# EAGLE design bridge (EAGLE 7.7.0)
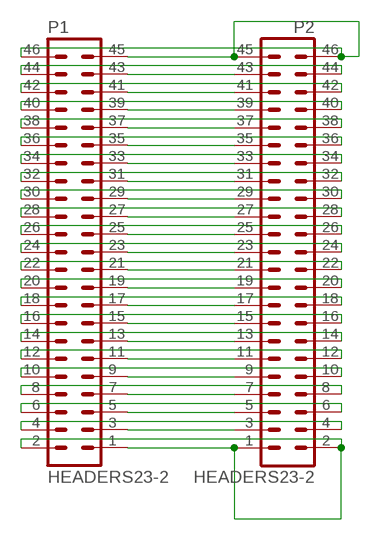
[diagram p0: schematic, sheet 1]

## Parts
P1  HEADERS23-2  [MA23-2]
P2  HEADERS23-2  [MA23-2]

## Nets
GND: P1.1 P1.2 P1.45 P1.46 P2.1 P2.2 P2.45 P2.46
N$2: P1.3 P2.3
N$3: P1.5 P2.5
N$4: P1.7 P2.7
N$5: P1.9 P2.9
N$6: P1.11 P2.11
N$7: P1.13 P2.13
N$8: P1.15 P2.15
N$9: P1.17 P2.17
N$10: P1.19 P2.19
N$11: P1.21 P2.21
N$12: P1.23 P2.23
N$13: P1.25 P2.25
N$14: P1.27 P2.27
N$15: P1.29 P2.29
N$16: P1.31 P2.31
N$17: P1.33 P2.33
N$18: P1.35 P2.35
N$19: P1.37 P2.37
N$20: P1.39 P2.39
N$21: P1.41 P2.41
N$22: P1.43 P2.43
N$25: P1.4 P2.4
N$26: P1.6 P2.6
N$27: P1.8 P2.8
N$28: P1.10 P2.10
N$29: P1.12 P2.12
N$30: P1.14 P2.14
N$31: P1.16 P2.16
N$32: P1.18 P2.18
N$33: P1.20 P2.20
N$34: P1.22 P2.22
N$35: P1.24 P2.24
N$36: P1.26 P2.26
N$37: P1.28 P2.28
N$38: P1.30 P2.30
N$39: P1.32 P2.32
N$40: P1.34 P2.34
N$41: P1.36 P2.36
N$42: P1.38 P2.38
N$43: P1.40 P2.40
N$44: P1.42 P2.42
N$45: P1.44 P2.44

## Library data of the parts
P1 P2 = 0000halfgaar:HEADERS23-2: Header 23x2

## Board
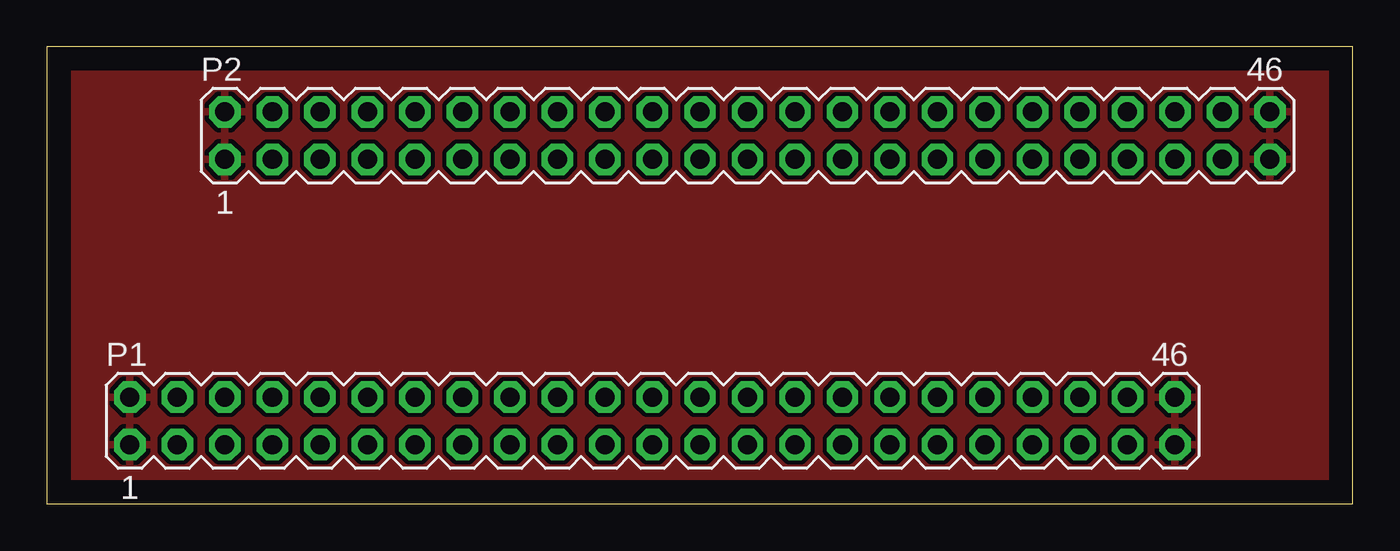
[diagram p1: board, top side]
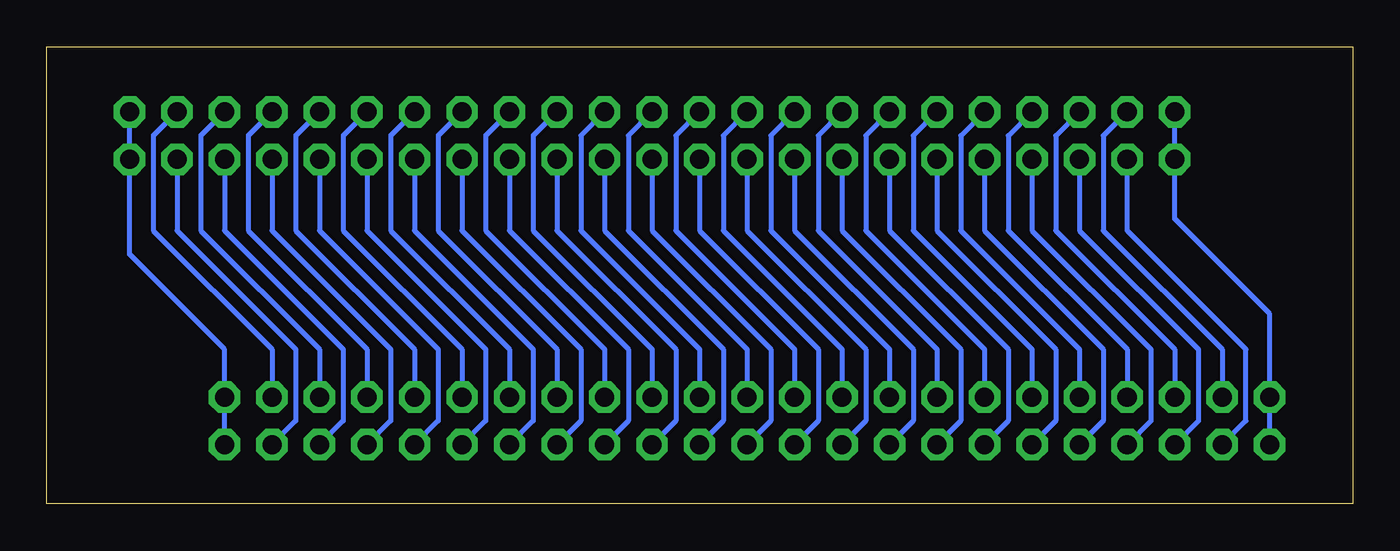
[diagram p2: board, bottom side, seen from below]

Size 69.83 x 24.43 mm. Coordinates in mm from the lower left corner, seen from the top.
Outline: 0,0 69.83,0 69.83,24.43 0,24.43 0,0
Copper layers (1*16): Top 0.035mm / dielectric 1.6mm / Bottom 0.035mm
Design rules "verysmall": minimum track width 10mil, minimum drill 31mil, track to track 9mil, track to pad 8mil, pad to pad 7mil, via to via 20mil, smd to smd 7mil, copper to edge 50mil, drill to drill 40mil, minimum pad ring 13mil, minimum via ring 13mil, stop-mask expansion 4mil, vias tented up to drill 0mil, thermal gap 10mil

### Footprints (pad centres in the part's own frame; a part is rotated, then mirrored left to right if it is on the bottom)
MA23-2 = drill 1.016 octagon: 1 -24.13,-1.27; 2 -24.13,1.27; 3 -21.59,-1.27; 4 -21.59,1.27; 5 -19.05,-1.27; 6 -19.05,1.27; 7 -16.51,-1.27; 8 -16.51,1.27; 9 -13.97,-1.27; 10 -13.97,1.27; 11 -11.43,-1.27; 12 -11.43,1.27; 13 -8.89,-1.27; 14 -8.89,1.27; 15 -6.35,-1.27; 16 -6.35,1.27; 17 -3.81,-1.27; 18 -3.81,1.27; 19 -1.27,-1.27; 20 -1.27,1.27; 21 1.27,-1.27; 22 1.27,1.27; 23 3.81,-1.27; 24 3.81,1.27; 25 6.35,-1.27; 26 6.35,1.27; 27 8.89,-1.27; 28 8.89,1.27; 29 11.43,-1.27; 30 11.43,1.27; 31 13.97,-1.27; 32 13.97,1.27; 33 16.51,-1.27; 34 16.51,1.27; 35 19.05,-1.27; 36 19.05,1.27; 37 21.59,-1.27; 38 21.59,1.27; 39 24.13,-1.27; 40 24.13,1.27; 41 26.67,-1.27; 42 26.67,1.27; 43 29.21,-1.27; 44 29.21,1.27; 45 31.75,-1.27; 46 31.75,1.27

### Placement (x,y rotation side)
P1  28.57,4.45 0 top
P2  33.66,19.68 0 top

### Tracks (layer width: path | path; a pad name or v marks a point on that pad's centre or on a via)
GND
  Bottom 0.254: P1.1 P1.2 4.45,10.16 9.53,15.24 P2.1 P2.2 | P1.45 P1.46 60.33,8.26 65.41,13.34 P2.45 P2.46
  pour Top: 1.27,24.13 1.27,1.27 68.58,1.27 68.58,24.13
N$2
  Bottom 0.254: P1.3 5.71,4.45 5.71,8.26 12.06,14.61 P2.3
N$3
  Bottom 0.254: P2.5 14.61,14.61 8.26,8.26 8.26,4.45 P1.5
N$4
  Bottom 0.254: P2.7 17.14,14.61 10.79,8.26 10.79,4.45 P1.7
N$5
  Bottom 0.254: P2.9 19.68,14.61 13.34,8.26 13.34,4.45 P1.9
N$6
  Bottom 0.254: P2.11 22.23,14.61 15.88,8.26 15.88,4.45 P1.11
N$7
  Bottom 0.254: P1.13 18.41,4.45 18.41,8.26 24.77,14.61 P2.13
N$8
  Bottom 0.254: P1.15 20.95,4.45 20.95,8.26 27.3,14.61 P2.15
N$9
  Bottom 0.254: P1.17 23.5,4.45 23.5,8.26 29.84,14.61 P2.17
N$10
  Bottom 0.254: P1.19 26.04,4.45 26.04,8.26 32.38,14.61 P2.19
N$11
  Bottom 0.254: P1.21 28.57,4.45 28.57,8.26 34.92,14.61 P2.21
N$12
  Bottom 0.254: P1.23 31.11,4.45 31.11,8.26 37.47,14.61 P2.23
N$13
  Bottom 0.254: P1.25 33.66,4.45 33.66,8.26 40.01,14.61 P2.25
N$14
  Bottom 0.254: P1.27 36.2,4.45 36.2,8.26 42.55,14.61 P2.27
N$15
  Bottom 0.254: P1.29 38.73,4.45 38.73,8.26 45.09,14.61 P2.29
N$16
  Bottom 0.254: P1.31 41.27,4.45 41.27,8.26 47.62,14.61 P2.31
N$17
  Bottom 0.254: P1.33 43.81,4.45 43.81,8.26 50.16,14.61 P2.33
N$18
  Bottom 0.254: P1.35 46.35,4.45 46.35,8.26 52.7,14.61 P2.35
N$19
  Bottom 0.254: P1.37 48.9,4.45 48.9,8.26 55.24,14.61 P2.37
N$20
  Bottom 0.254: P1.39 51.44,4.45 51.44,8.26 57.78,14.61 P2.39
N$21
  Bottom 0.254: P1.41 53.98,4.45 53.98,8.26 60.33,14.61 P2.41
N$22
  Bottom 0.254: P1.43 56.52,4.45 56.52,8.26 62.87,14.61 P2.43
N$25
  Bottom 0.254: P2.4 13.34,19.68 13.34,14.61 6.99,8.26 P1.4
N$26
  Bottom 0.254: P2.6 15.88,19.68 15.88,14.61 9.53,8.26 P1.6
N$27
  Bottom 0.254: P2.8 18.41,19.68 18.41,14.61 12.06,8.26 P1.8
N$28
  Bottom 0.254: P2.10 20.95,19.68 20.95,14.61 14.61,8.26 P1.10
N$29
  Bottom 0.254: P2.12 23.5,19.68 23.5,14.61 17.14,8.26 P1.12
N$30
  Bottom 0.254: P2.14 26.04,19.68 26.04,14.61 19.68,8.26 P1.14
N$31
  Bottom 0.254: P2.16 28.57,19.68 28.57,14.61 22.23,8.26 P1.16
N$32
  Bottom 0.254: P2.18 31.11,19.68 31.11,14.61 24.77,8.26 P1.18
N$33
  Bottom 0.254: P2.20 33.66,19.68 33.66,14.61 27.3,8.26 P1.20
N$34
  Bottom 0.254: P2.22 36.2,19.68 36.2,14.61 29.84,8.26 P1.22
N$35
  Bottom 0.254: P2.24 38.73,19.68 38.73,14.61 32.38,8.26 P1.24
N$36
  Bottom 0.254: P2.26 41.27,19.68 41.27,14.61 34.92,8.26 P1.26
N$37
  Bottom 0.254: P2.28 43.81,19.68 43.81,14.61 37.47,8.26 P1.28
N$38
  Bottom 0.254: P2.30 46.35,19.68 46.35,14.61 40.01,8.26 P1.30
N$39
  Bottom 0.254: P2.32 48.9,19.68 48.9,14.61 42.55,8.26 P1.32
N$40
  Bottom 0.254: P2.34 51.44,19.68 51.44,14.61 45.09,8.26 P1.34
N$41
  Bottom 0.254: P2.36 53.98,19.68 53.98,14.61 47.62,8.26 P1.36
N$42
  Bottom 0.254: P2.38 56.52,19.68 56.52,14.61 50.16,8.26 P1.38
N$43
  Bottom 0.254: P2.40 59.05,19.68 59.05,14.61 52.7,8.26 P1.40
N$44
  Bottom 0.254: P2.42 61.59,19.68 61.59,14.61 55.24,8.26 P1.42
N$45
  Bottom 0.254: P2.44 64.14,19.68 64.14,14.61 57.78,8.26 P1.44